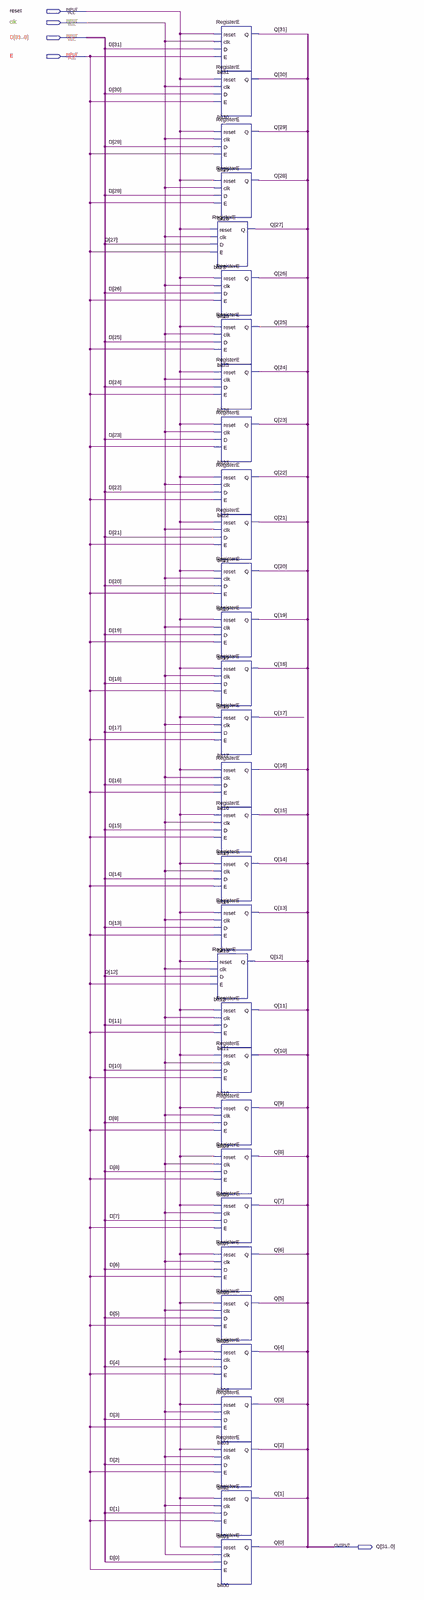
[diagram p0: schematic sheet, whole]
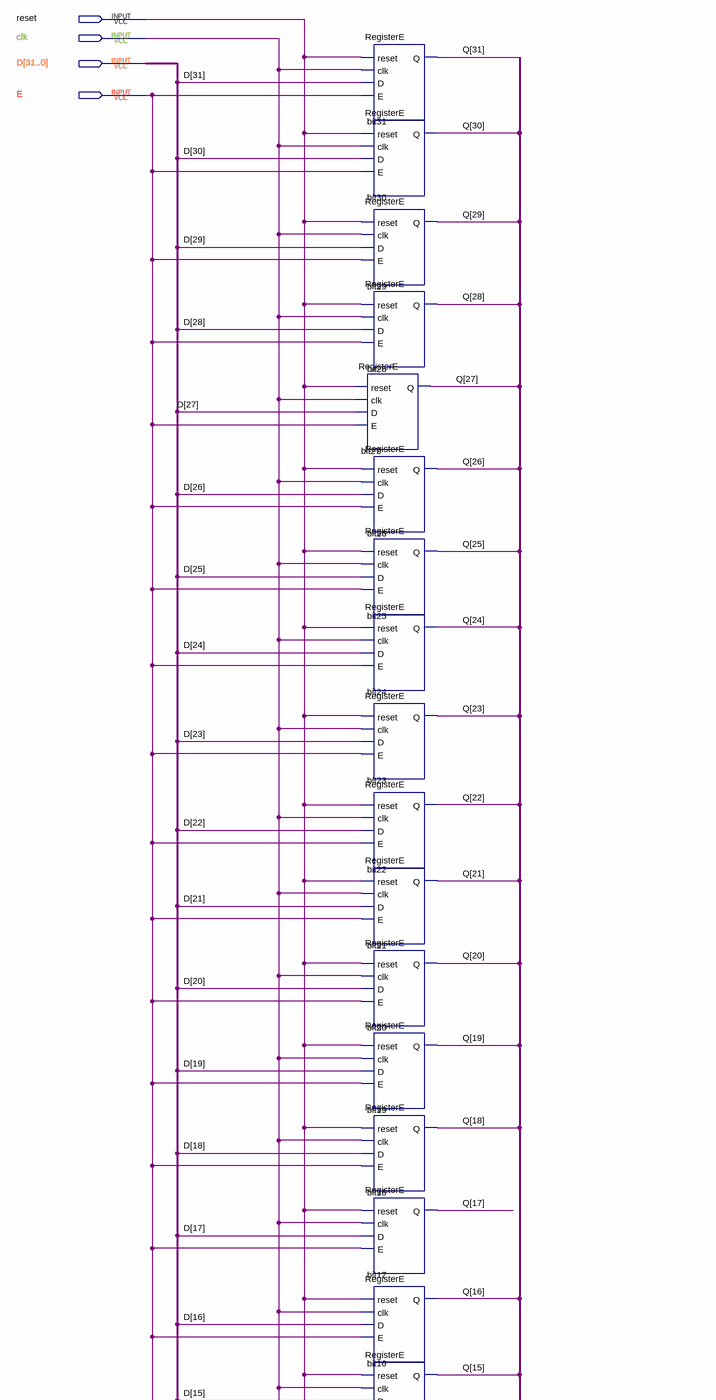
[diagram p1: schematic sheet, upper part]
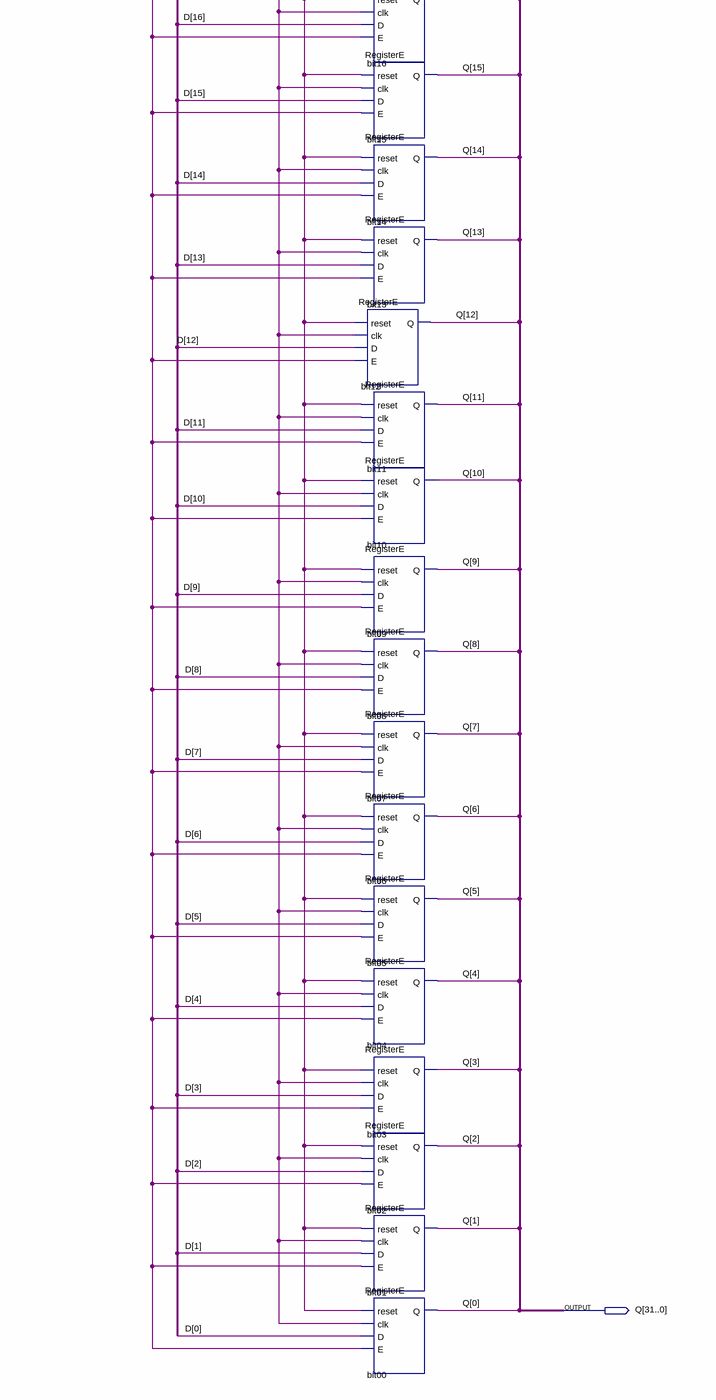
[diagram p2: schematic sheet, lower part]
// Quartus schematic RegisterE_32.bdf as structural Verilog: 32 symbols, 5 pins
module RegisterE_32 (
  input  reset,
  input  clk,
  input  [31:0] D,
  input  E,
  output [31:0] Q
);

  RegisterE bit31 (.reset(reset), .clk(clk), .D(D[31]), .E(E), .Q(Q[31]));
  RegisterE bit30 (.reset(reset), .clk(clk), .D(D[30]), .E(E), .Q(Q[30]));
  RegisterE bit29 (.reset(reset), .clk(clk), .D(D[29]), .E(E), .Q(Q[29]));
  RegisterE bit28 (.reset(reset), .clk(clk), .D(D[28]), .E(E), .Q(Q[28]));
  RegisterE bit27 (.reset(reset), .clk(clk), .D(D[27]), .E(E), .Q(Q[27]));
  RegisterE bit26 (.reset(reset), .clk(clk), .D(D[26]), .E(E), .Q(Q[26]));
  RegisterE bit25 (.reset(reset), .clk(clk), .D(D[25]), .E(E), .Q(Q[25]));
  RegisterE bit24 (.reset(reset), .clk(clk), .D(D[24]), .E(E), .Q(Q[24]));
  RegisterE bit23 (.reset(reset), .clk(clk), .D(D[23]), .E(E), .Q(Q[23]));
  RegisterE bit22 (.reset(reset), .clk(clk), .D(D[22]), .E(E), .Q(Q[22]));
  RegisterE bit21 (.reset(reset), .clk(clk), .D(D[21]), .E(E), .Q(Q[21]));
  RegisterE bit20 (.reset(reset), .clk(clk), .D(D[20]), .E(E), .Q(Q[20]));
  RegisterE bit19 (.reset(reset), .clk(clk), .D(D[19]), .E(E), .Q(Q[19]));
  RegisterE bit18 (.reset(reset), .clk(clk), .D(D[18]), .E(E), .Q(Q[18]));
  RegisterE bit17 (.reset(reset), .clk(clk), .D(D[17]), .E(E), .Q(Q[17]));
  RegisterE bit16 (.reset(reset), .clk(clk), .D(D[16]), .E(E), .Q(Q[16]));
  RegisterE bit15 (.reset(reset), .clk(clk), .D(D[15]), .E(E), .Q(Q[15]));
  RegisterE bit14 (.reset(reset), .clk(clk), .D(D[14]), .E(E), .Q(Q[14]));
  RegisterE bit13 (.reset(reset), .clk(clk), .D(D[13]), .E(E), .Q(Q[13]));
  RegisterE bit12 (.reset(reset), .clk(clk), .D(D[12]), .E(E), .Q(Q[12]));
  RegisterE bit11 (.reset(reset), .clk(clk), .D(D[11]), .E(E), .Q(Q[11]));
  RegisterE bit10 (.reset(reset), .clk(clk), .D(D[10]), .E(E), .Q(Q[10]));
  RegisterE bit09 (.reset(reset), .clk(clk), .D(D[9]), .E(E), .Q(Q[9]));
  RegisterE bit08 (.reset(reset), .clk(clk), .D(D[8]), .E(E), .Q(Q[8]));
  RegisterE bit07 (.reset(reset), .clk(clk), .D(D[7]), .E(E), .Q(Q[7]));
  RegisterE bit06 (.reset(reset), .clk(clk), .D(D[6]), .E(E), .Q(Q[6]));
  RegisterE bit05 (.reset(reset), .clk(clk), .D(D[5]), .E(E), .Q(Q[5]));
  RegisterE bit04 (.reset(reset), .clk(clk), .D(D[4]), .E(E), .Q(Q[4]));
  RegisterE bit03 (.reset(reset), .clk(clk), .D(D[3]), .E(E), .Q(Q[3]));
  RegisterE bit02 (.reset(reset), .clk(clk), .D(D[2]), .E(E), .Q(Q[2]));
  RegisterE bit01 (.reset(reset), .clk(clk), .D(D[1]), .E(E), .Q(Q[1]));
  RegisterE bit00 (.reset(reset), .clk(clk), .D(D[0]), .E(E), .Q(Q[0]));
endmodule
